# Altium project DE26.PrjPcb
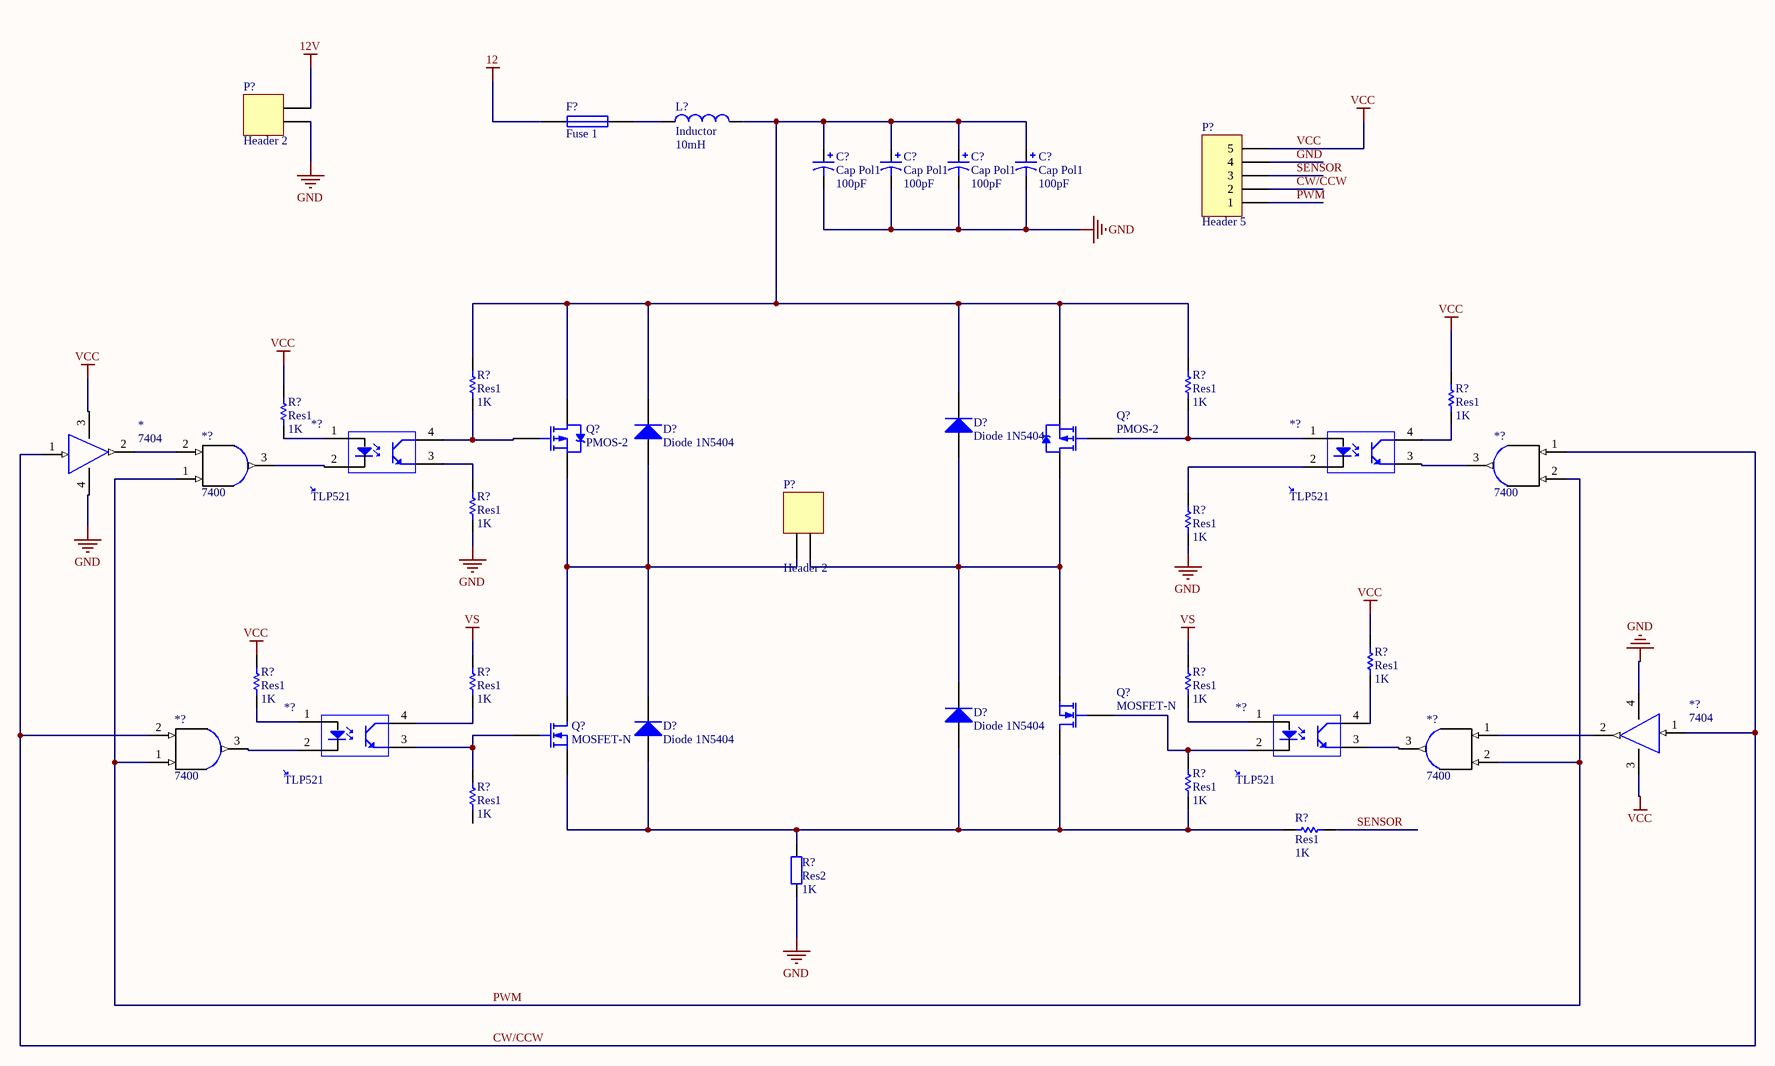
[diagram p0: Sheet1.SchDoc]
1 sheet, 41 parts. Net scope: global (net labels, ports and power ports of the same name join across sheets).

## Sheet Sheet1.SchDoc
size A3; SheetNumber: 1; SheetTotal: 1; SPICEModelCacheGZZFDIFM: <root> / <DocumentId>GZZFDIFM</DocumentId> / <CacheFrame Number="0"> / <Model Name="fuse" Kind="CKT"> / <Text>.SUBCKT FUSE 1 2 PARAMS: CURRENT=1 RESISTANCE=1m / SW1 1 2 3 0 SMOD OFF / BNLV 3 0 V=(abs(v(1,2))) / .MODEL SMOD SW (VT={(CURRENT*RESISTANCE)} RON=1g ROFF={RESISTANCE}) / .ENDS FUSE</Text> / </Model> / <Model Name="irf9510" Kind="CKT"> / <Text>*IRF9510  MCE  4-2-96 / *100V  4A  1.2 ohms HEXFET pkg:TO-220 2,1,3 / .SUBCKT IRF9510  10 20 40 40 / M1   1  2  3  3  DMOS L=1U W=1U / RD  10  1  .569 / RS  30  3  31M / RG  20  2  37.5 / CGS  2  3  182P / EGD 12  0  1  2  1 / VFB 14  0  0 / FFB  1  2  VFB  1 / CGD 13 14  231P / R1  13  0  1 / D1  12 13  DLIM / DDG 15 14  DCGD / R2  12 15  1 / D2  15  0  DLIM / DSD 10  3  DSUB / LS  30 40  7.5N / .MODEL DMOS PMOS (LEVEL=3 THETA=60M VMAX=208K ETA=2M VTO=-3 KP=.471) / .MODEL DCGD D (CJO=231P VJ=.6 M=.68) / .MODEL DSUB D (IS=16.6N N=1.5 RS=1.18 BV=100 CJO=327P VJ=.8 M=.42 TT=82N) / .MODEL DLIM D (IS=100U) / .ENDS IRF9510</Text> / </Model> / <Model Name="1n5404" Kind="MDL"> / <Text>*1N5404 MCE / *400V 3A Si Rectifier pkg:DO-201 1,2 / .MODEL 1N5404 D(IS=2.68E-12 RS=0.00731 N=1.17 TT=1.44E-5 CJO=1.24E-10 / + VJ=0.6 M=0.333 BV=533 IBV=1E-5 )</Text> / </Model> / <Model Name="nmos" Kind="MDL"> / <Text>*Default N-Channel MOSFET / *Pinout: D,G,S / .MODEL NMOS NMOS()</Text> / </Model> / </CacheFrame> / </root>

### Parts
(Parts that share a designator on the sheet are numbered #1, #2 ... from top to bottom, then left to right.)
*  7404
*?#1  7400
*?#2  TLP521
*?#3  TLP521
*?#4  7400
*?#5  7404
*?#6  7400
*?#7  TLP521
*?#8  TLP521
*?#9  7400
C?#1  Cap Pol1  value 100pF  [RB7.6-15]
C?#2  Cap Pol1  value 100pF  [RB7.6-15]
C?#3  Cap Pol1  value 100pF  [RB7.6-15]
C?#4  Cap Pol1  value 100pF  [RB7.6-15]
D?#1  Diode 1N5404  [DO-201AD]
D?#2  Diode 1N5404  [DO-201AD]
D?#3  Diode 1N5404  [DO-201AD]
D?#4  Diode 1N5404  [DO-201AD]
F?  Fuse 1  [PIN-W2/E2.8]
L?  Inductor  value 10mH  [0402-A]
P?#1  Header 2  [HDR1X2]
P?#2  Header 5  [HDR1X5]
P?#3  Header 2  [HDR1X2]
Q?#1  PMOS-2  [TO-220AB]
Q?#2  PMOS-2  [TO-220AB]
Q?#3  MOSFET-N  [E3]
Q?#4  MOSFET-N  [E3]
R?#1  Res1  value 1K  [AXIAL-0.3]
R?#2  Res1  value 1K  [AXIAL-0.3]
R?#3  Res1  value 1K  [AXIAL-0.3]
R?#4  Res1  value 1K  [AXIAL-0.3]
R?#5  Res1  value 1K  [AXIAL-0.3]
R?#6  Res1  value 1K  [AXIAL-0.3]
R?#7  Res1  value 1K  [AXIAL-0.3]
R?#8  Res1  value 1K  [AXIAL-0.3]
R?#9  Res1  value 1K  [AXIAL-0.3]
R?#10  Res1  value 1K  [AXIAL-0.3]
R?#11  Res1  value 1K  [AXIAL-0.3]
R?#12  Res1  value 1K  [AXIAL-0.3]
R?#13  Res1  value 1K  [AXIAL-0.3]
R?#14  Res2  value 1K  [AXIAL-0.4]

### Nets
12: F?.1
12V: P?#1.2
GND: *.4 *?#5.4 C?#1.2 C?#2.2 C?#3.2 C?#4.2 P?#1.1 P?#2.4 R?#5.1 R?#6.1 R?#14.1
VCC: *.3 *?#5.3 P?#2.5 R?#3.2 R?#4.2 R?#8.2 R?#9.2
VS: R?#7.1 R?#10.2
CW/CCW: *.1 *?#4.1 *?#5.1 *?#6.2 P?#2.2
PWM: *?#1.1 *?#4.2 *?#6.1 *?#9.2 P?#2.1
SENSOR: P?#2.3 R?#13.2
Net*?#1_3: *?#1.3 *?#2.2
Net*?#2_1: *?#2.1 R?#4.1
Net*?#2_3: *?#2.3 R?#5.2
Net*?#2_4: *?#2.4 Q?#1.1(G) R?#1.1
Net*?#3_1: *?#3.1 Q?#2.1(G) R?#2.1
Net*?#3_2: *?#3.2 R?#6.2
Net*?#3_3: *?#3.3 *?#4.3
Net*?#3_4: *?#3.4 R?#3.1
Net*?#5_2: *?#5.2 *?#9.1
Net*?#6_3: *?#6.3 *?#7.2
Net*?#7_1: *?#7.1 R?#9.1
Net*?#7_3: *?#7.3 Q?#3.2(G) R?#12.2
Net*?#7_4: *?#7.4 R?#10.1
Net*?#8_1: *?#8.1 R?#7.2
Net*?#8_2: *?#8.2 Q?#4.2(G) R?#11.1
Net*?#8_3: *?#8.3 *?#9.3
Net*?#8_4: *?#8.4 R?#8.1
Net*_2: *.2 *?#1.2
NetC?#1_1: C?#1.1 C?#2.1 C?#3.1 C?#4.1 D?#1.2(K) D?#2.2(K) L?.2 Q?#1.2(D) Q?#2.3(S) R?#1.2 R?#2.2
NetD?#1_1: D?#1.1(A) D?#3.2(K) P?#3.2 Q?#2.2(D) Q?#4.3(S)
NetD?#2_1: D?#2.1(A) D?#4.2(K) P?#3.1 Q?#1.3(S) Q?#3.1(D)
NetD?#3_1: D?#3.1(A) D?#4.1(A) Q?#3.3(S) Q?#4.1(D) R?#11.2 R?#13.1 R?#14.2
NetF?_2: F?.2 L?.1

Not connected (* = marked no-connect by the designer): R?#12 1

### Library data of the parts
C?#1-C?#4 = Cap Pol1: Polarized Capacitor (Radial); Published: 8-Jun-2000; LatestRevisionDate: 17-Jul-2002; LatestRevisionNote: Re-released for DXP Platform.; PackageReference: RB7.6-15; Publisher: Altium Limited; PackageDescription: Polarized Capacitor (Radial); 2 Leads
D?#1-D?#4 = Diode 1N5404: 3 Amp General Purpose Rectifier; Published: 8-Jun-2000; LatestRevisionDate: 17-Jul-2002; LatestRevisionNote: Re-released for DXP Platform.; DatasheetVersion: 1998; PackageVersion: Aug-1999; PackageReference: DO-201AD; Publisher: Altium Limited; PackageDescription: Diode, Axial; Body 9.5 x 5.6 mm (LxDia. max), Lead Dia. 1.32 mm (max); ComponentLink1Description: Manufacturer Link; ComponentLink1URL: http://www.fairchildsemi.com/; ComponentLink2Description: Datasheet; ComponentLink2URL: http://www.fairchildsemi.com/ds/1N%2F1N5400.pdf
F? = Fuse 1: Fuse; Published: 8-Jun-2000; LatestRevisionDate: 17-Jul-2002; LatestRevisionNote: Re-released for DXP Platform.; PackageReference: PIN-W2/E2.8; Publisher: Altium Limited; PackageDescription: Thru-Hole; 2 Leads
L? = Inductor: Code_IEC: 1005; Published: 8-Jun-2000; LatestRevisionDate: 29-May-2009; LatestRevisionNote: IPC-7351 Footprint Added.; PackageReference: 0402-A; Publisher: Altium Limited; PackageDescription: Chip Inductor; Code_JEITA: 0402
P?#1 P?#3 = Header 2: Header, 2-Pin; LatestRevisionDate: 17-Jul-2002; LatestRevisionNote: Re-released for DXP Platform.; Publisher: Altium Limited
P?#2 = Header 5: Header, 5-Pin; LatestRevisionDate: 17-Jul-2002; LatestRevisionNote: Re-released for DXP Platform.; Publisher: Altium Limited
Q?#1 Q?#2 = PMOS-2: P-Channel Power MOSFET; Note: Pin 4 not drawn and electrically connected to Pin 2.; Published: 8-Jun-2000; LatestRevisionDate: 17-Jul-2002; LatestRevisionNote: Re-released for DXP Platform.; DatasheetVersion: PD-9.390D; PackageVersion: Feb-1997; PackageReference: TO-220AB; Publisher: Altium Limited; PackageDescription: TO, Thru-Hole, Vertical, Heatsink Mounted; 3 In-Line Leads; Pitch 2.54 mm; ComponentLink1Description: Manufacturer Link; ComponentLink1URL: http://www.irf.com/
Q?#3 Q?#4 = MOSFET-N: N-Channel MOSFET; Published: 8-Jun-2000; LatestRevisionDate: 17-Jul-2002; LatestRevisionNote: Re-released for DXP Platform.; PackageVersion: 1995/1996; PackageReference: E3; Publisher: Altium Limited; PackageDescription: TO, Flat Index; 3 In-Line, Axial Leads; Body Dia. 4.6mm; Lead Dia. 0.5 mm (max)
R?#1-R?#13 = Res1: Resistor; Published: 8-Jun-2000; LatestRevisionDate: 17-Jul-2002; LatestRevisionNote: Re-released for DXP Platform.; PackageReference: AXIAL-0.3; Publisher: Altium Limited; PackageDescription: Axial Device, Thru-Hole; 2 Leads; 0.3 in Pin Spacing
R?#14 = Res2: Resistor; Published: 8-Jun-2000; LatestRevisionDate: 17-Jul-2002; LatestRevisionNote: Re-released for DXP Platform.; PackageReference: AXIAL-0.4; Publisher: Altium Limited; PackageDescription: Axial Device, Thru-Hole; 2 Leads; 0.4 in Pin Spacing